# EAGLE design cherry-mx-1 (EAGLE 6.4)
AUTHOR_NAME: kps; PROJECT_NAME: Keyswitch breakout; VERSION: 20130907
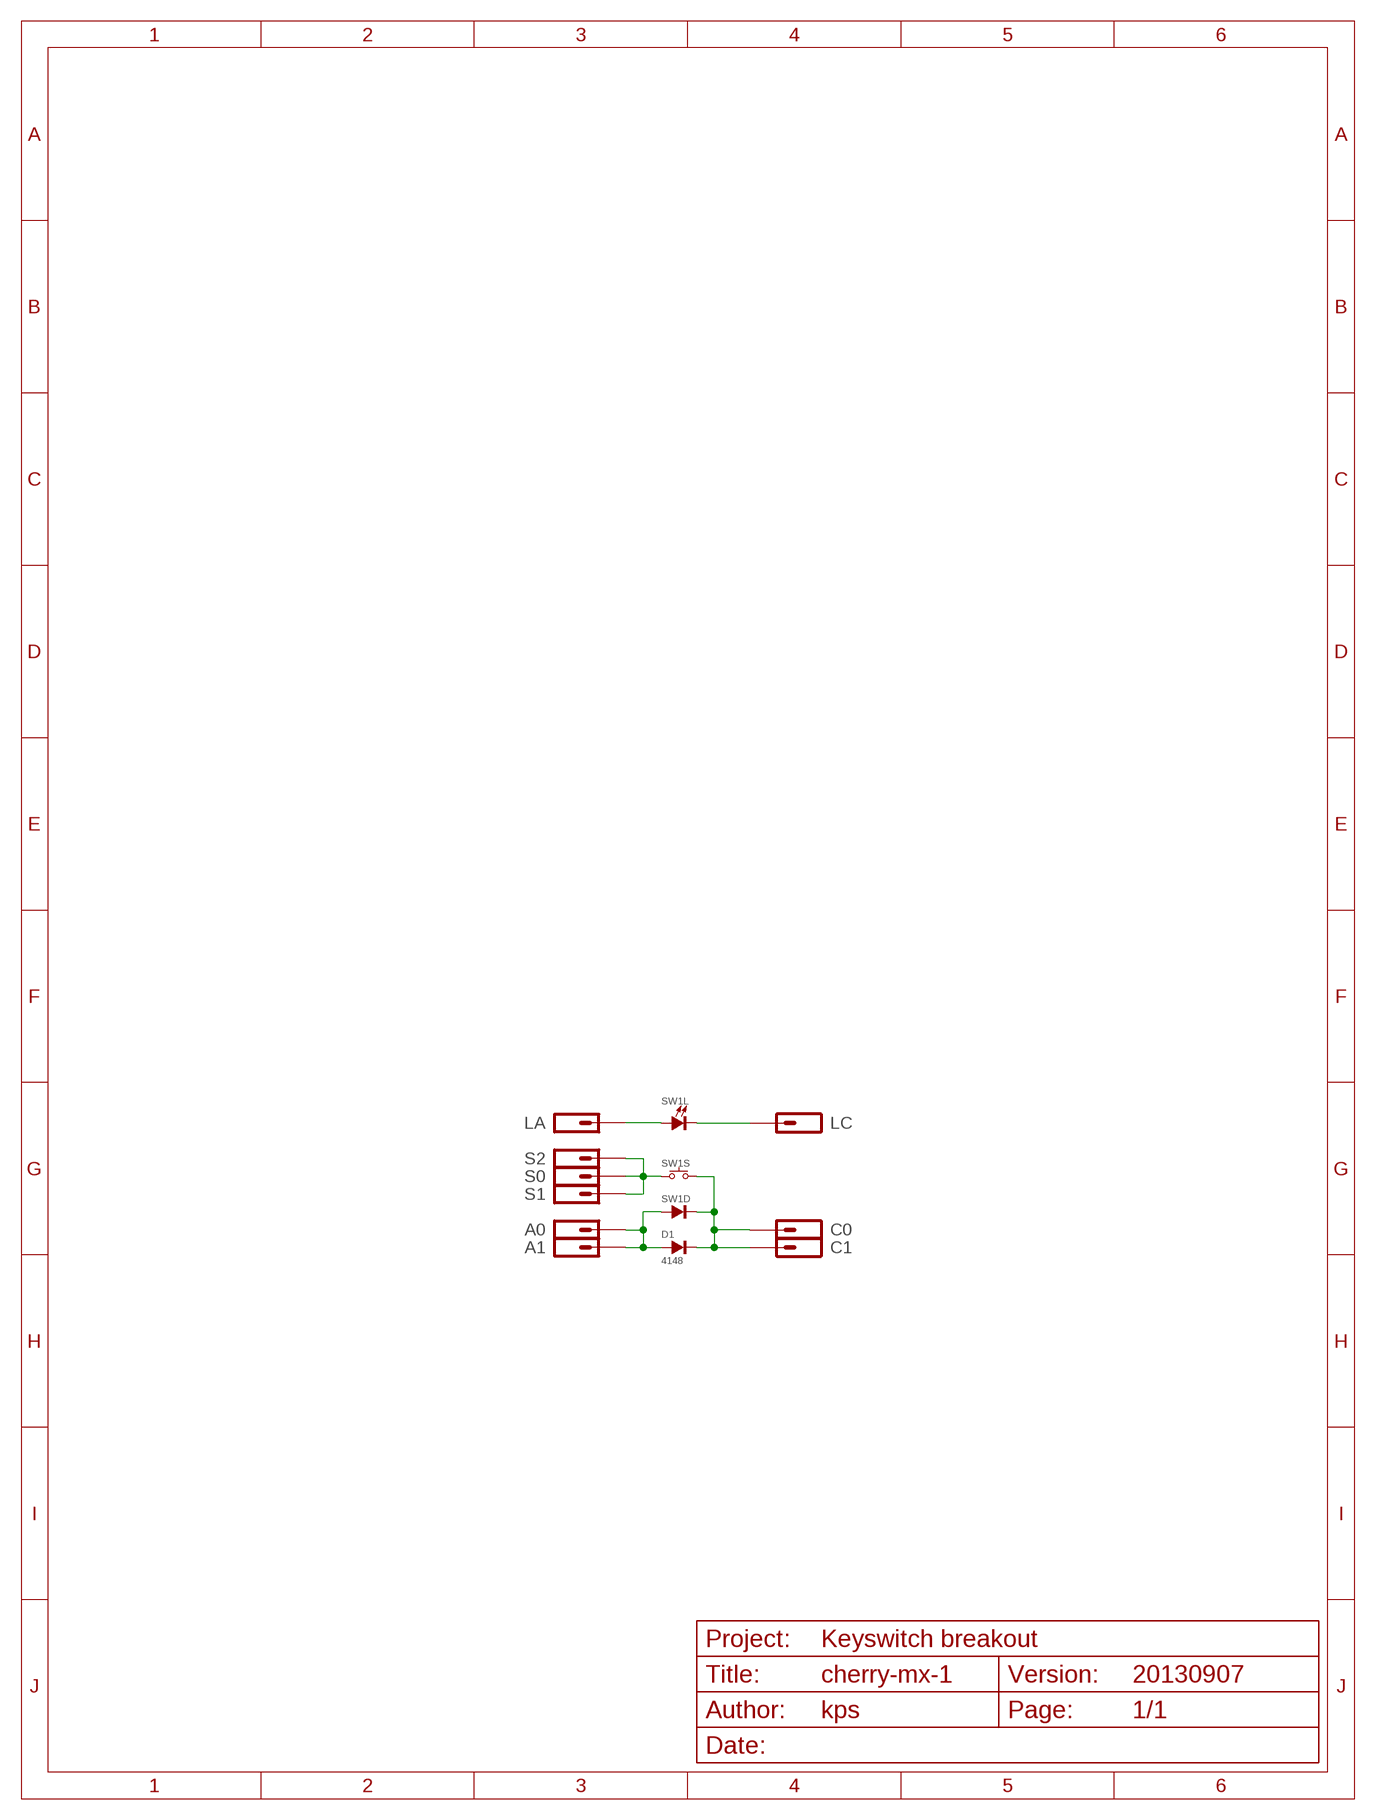
[diagram p0: schematic, sheet 1]

## Parts
A0  J-1-SQUARE-70  [J-1-SQUARE-70]
A1  J-1-SQUARE-74  [J-1-SQUARE-74]
C0  J-1-SQUARE-70  [J-1-SQUARE-70]
C1  J-1-SQUARE-74  [J-1-SQUARE-74]
D1  4148  DIODE-SMA+SOD323-NOSS  [SMA+SOD323-P-NOSS]
LA  J-1-OCTAGON-70  [J-1-OCTAGON-70]
LC  J-1-OCTAGON-70  [J-1-OCTAGON-70]
S0  J-1-ROUND-70  [J-1-ROUND-70]
S1  J-1-ROUND-74  [J-1-ROUND-74]
S2  J-1-ROUND-74  [J-1-ROUND-74]
SW1  SW-CHERRY-MX-BOTH  [SW-CHERRY-MX-BOTH]

## Nets
A: A0.1 A1.1 D1.A SW1.A(D:A)
C: C0.1 C1.1 D1.C SW1.C(D:C) SW1.S2
LA: LA.1 SW1.LA(L:A)
LC: LC.1 SW1.LC(L:C)
S: S0.1 S1.1 S2.1 SW1.S1

## Library data of the parts
A0 A1 C0 C1 LA LC S0 S1 S2 = conn:J-1: 1 pin connector
D1 = misc:DIODE
SW1 = switch:SW-CHERRY-MX-BOTH: Cherry MX switch, with matrix diode and LED This is not a physically possible switch, but may be useful for layout.

## Board
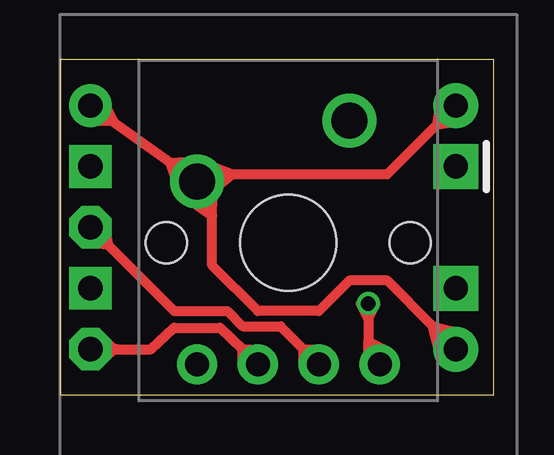
[diagram p1: board, top side]
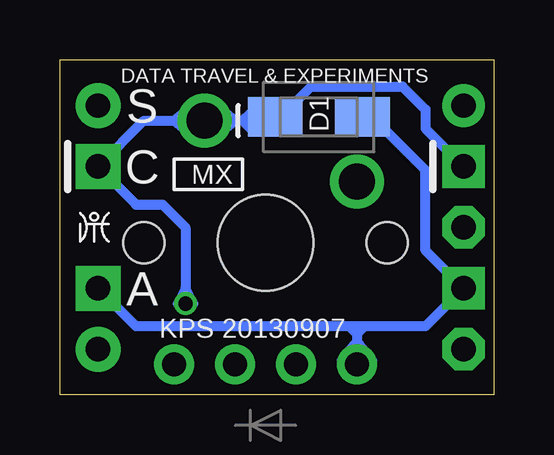
[diagram p2: board, bottom side, seen from below]

Size 18.1 x 13.97 mm. Coordinates in mm from the lower left corner, seen from the top.
Outline: 0,0 18.1,0 18.1,13.97 0,13.97 0,0
Copper layers (1*16): Top 0.0356mm / dielectric 1.5011mm / Bottom 0.0356mm
Design rules "LaenPCBOrder": minimum track width 6mil, minimum drill 13mil, track to track 6mil, track to pad 6mil, pad to pad 6mil, via to via 6mil, smd to smd 6mil, copper to edge 15mil, drill to drill 6mil, minimum pad ring 7mil, minimum via ring 7mil, stop-mask expansion 4mil, vias tented up to drill 0mil, thermal gap 10mil

### Footprints (pad centres in the part's own frame; a part is rotated, then mirrored left to right if it is on the bottom)
J-1-SQUARE-70 = drill 1.016 pad 1.778 square: 1 0,0
J-1-SQUARE-74 = drill 1.016 pad 1.88 square: 1 0,0
SMA+SOD323-P-NOSS = smd 2.286 x 1.651: A -1.816,0; C 1.816,0
J-1-OCTAGON-70 = drill 1.016 pad 1.778 octagon: 1 0,0
J-1-ROUND-70 = drill 1.016 pad 1.778: 1 0,0
J-1-ROUND-74 = drill 1.016 pad 1.88: 1 0,0
SW-CHERRY-MX-BOTH = drill 1 pad 1.68: A -3.81,-5.08; C 3.81,-5.08; LA -1.27,-5.08; LC 1.27,-5.08 | drill 1.5 pad 2.184: S1 -3.81,2.54; S2 2.54,5.08 | hole 4: 0,0 | hole 1.714: -5.08,0; 5.08,0

### Placement (x,y rotation side)
A0  1.27,4.45 0 top
A1  16.51,4.45 0 top
C0  1.27,9.53 0 top
C1  16.51,9.53 0 top
D1  7.3,11.59 180 bottom
LA  1.27,1.91 0 top
LC  1.27,6.99 0 top
S0  1.27,12.06 0 top
S1  16.51,12.06 0 top
S2  16.51,1.91 0 top
SW1  9.53,6.35 0 top
U$1  [GLYPH-DT&E-50]  16.67,6.99 0 bottom

### Tracks (layer width: path | path; a pad name or v marks a point on that pad's centre or on a via)
A
  Bottom 0.305: 5.71,2.54 5.71,2.86 | 4.76,11.27 4.76,11.59 D1.A
  Bottom 0.406: 5.4,2.86 2.86,2.86 A0.1 2.86,6.03 2.86,9.37 4.76,11.27 | 5.4,2.86 5.71,2.86 6.03,2.86 | 6.03,2.86 14.92,2.86 A1.1 | 5.4,2.86 5.71,2.54 | 5.71,2.54 6.03,2.86 | 5.71,2.54 5.71,2.22 | 5.71,2.22 SW1.A | 5.08,1.43 5.71,2.22 | 5.71,2.22 6.35,1.43
C  (via drill 0.6)
  Top 0.305: v12.86,3.81 12.86,3.17
  Top 0.406: 12.86,3.17 12.86,2.22 | 12.86,2.22 13.49,1.91 | 12.54,3.81 12.86,3.17 | 12.86,3.17 13.18,3.81 | SW1.C 12.86,1.27 12.86,2.22
  Bottom 0.305: 8.89,11.43 D1.C 8.41,12.06 | 12.86,4.45 v12.86,3.81
  Bottom 0.406: 10.48,11.43 D1.C | 8.41,12.06 7.62,12.86 3.81,12.86 2.86,11.91 2.86,11.11 C0.1 | 10.16,11.75 10.48,11.43 | 10.48,11.43 10.16,11.11 | 13.34,11.43 14.61,11.43 C1.1 14.92,7.94 13.81,7.94 12.86,6.99 12.86,4.45 | 13.34,11.43 SW1.S2 10.79,11.43 | 10.48,11.43 10.79,11.43 | 12.54,3.81 12.86,4.45 | 12.86,4.45 13.18,3.81 | 12.38,10.64 13.34,11.43 | 13.34,11.43 12.38,12.22 | 11.75,12.22 10.79,11.43 | 10.79,11.43 11.75,10.64
LA
  Top 0.305: 1.59,2.54 2.38,1.91 1.59,1.27
  Top 0.406: LA.1 2.38,1.91 3.81,1.91 4.76,2.79 6.67,2.79 7.62,1.91 | 7.62,1.91 SW1.LA | 7.62,1.27 7.62,1.91 | 7.62,1.91 8.26,1.91
LC
  Top 0.305: 1.91,7.3 2.06,6.19 0.95,6.35
  Top 0.406: LC.1 2.06,6.19 4.76,3.49 6.99,3.49 7.62,2.86 9.21,2.86 10.16,1.91 | 10.16,1.91 SW1.LC | 10.16,1.27 10.16,1.91 | 10.16,1.91 10.79,1.91
S
  Top 0.305: 6.51,8.57 7.3,9.21 6.03,9.68 | 1.43,11.43 S0.1
  Top 0.406: 15.72,11.27 13.65,9.21 7.3,9.21 6.51,9.21 6.35,7.94 6.35,7.46 | 15.72,11.27 S1.1 | S2.1 15.56,2.86 | 15.56,2.86 13.65,4.76 12.06,4.76 10.79,3.49 8.26,3.49 6.35,5.4 6.35,7.46 | 15.88,1.59 15.56,2.86 | 15.56,2.86 16.83,2.54 | 15.88,12.38 15.72,11.27 | 15.72,11.27 16.83,11.43 | 6.35,7.46 5.4,8.1 | SW1.S1 4.6,9.68 | 4.6,9.68 S0.1 | 4.6,9.68 4.92,8.73 4.92,9.68 6.03,9.68 | 4.6,9.68 5.4,9.68 | 1.43,11.43 2.22,11.43 1.75,12.38

### Text on the board
bPlace: DATA TRAVEL & EXPERIMENTS | S | C | MX | A | KPS 20130907